# Altium schematic sheet Power_Measurement.SchDoc
size A4
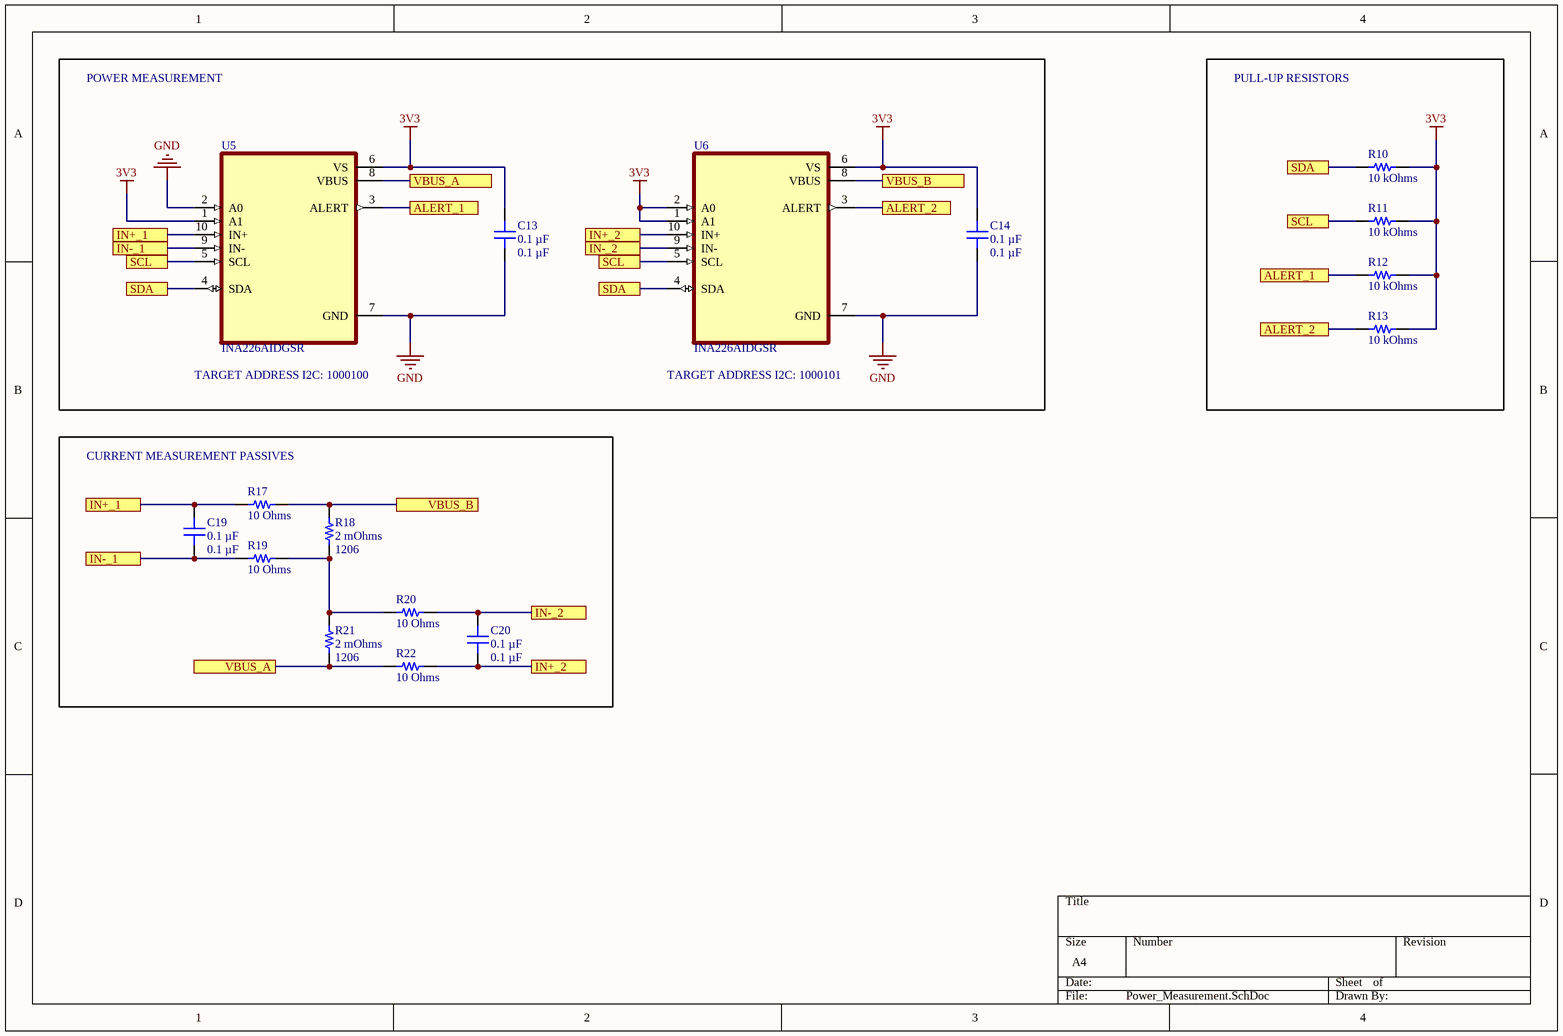
[diagram p0: Power_Measurement.SchDoc]

## Parts
C13  0.1 µF  [CAP 0603_1608]
C14  0.1 µF  [CAP 0603_1608]
C19  0.1 µF  [CAP 0603_1608]
C20  0.1 µF  [CAP 0603_1608]
R10  10 kOhms  [RES 0603_1608]
R11  10 kOhms  [RES 0603_1608]
R12  10 kOhms  [RES 0603_1608]
R13  10 kOhms  [RES 0603_1608]
R17  10 Ohms  [RES 0603_1608]
R18  2 mOhms  Package / Case: 1206  [STACKPOLE CSR1206]
R19  10 Ohms  [RES 0603_1608]
R20  10 Ohms  [RES 0603_1608]
R21  2 mOhms  Package / Case: 1206  [STACKPOLE CSR1206]
R22  10 Ohms  [RES 0603_1608]
U5  INA226AIDGSR  [SOP50P490X110-10N]
U6  INA226AIDGSR  [SOP50P490X110-10N]

## Blocks framed on the sheet
PULL-UP RESISTORS: R10-R13
CURRENT MEASUREMENT PASSIVES: C19 C20 R17-R22

## Ports
ALERT_1, ALERT_2, IN+_1, IN+_2, IN-_1, IN-_2, SCL, SDA, VBUS_A, VBUS_B

## Nets
3V3: C13.1 C14.2 R10.1 R11.1 R12.1 R13.1 U5.1(A1) U5.6(VS) U6.1(A1) U6.2(A0) U6.6(VS)
GND: C13.2 C14.1 U5.2(A0) U5.7(GND) U6.7(GND)
ALERT_1: R12.2 U5.3(ALERT) ; port ALERT_1
ALERT_2: R13.2 U6.3(ALERT) ; port ALERT_2
IN+_1: C19.2 R17.2 U5.10(IN+) ; port IN+_1
IN+_2: C20.2 R22.2 U6.10(IN+) ; port IN+_2
IN-_1: C19.1 R19.2 U5.9(IN-) ; port IN-_1
IN-_2: C20.1 R20.2 U6.9(IN-) ; port IN-_2
SCL: R11.2 U5.5(SCL) U6.5(SCL) ; port SCL
SDA: R10.2 U5.4(SDA) U6.4(SDA) ; port SDA
VBUS_A: R21.1 R22.1 U5.8(VBUS) ; port VBUS_A
VBUS_B: R17.1 R18.2 U6.8(VBUS) ; port VBUS_B
NetR18_1: R18.1 R19.1 R20.1 R21.2

## Notes on the sheet
- POWER MEASUREMENT
- TARGET ADDRESS I2C: 1000100
- TARGET ADDRESS I2C: 1000101

## Library data of the parts
C13 C14 C19 C20 = C0603C104K5RAC7411: CAP CER 0.1UF 50V X7R 0603; manufacturer: KEMET; Tolerance: ±10%; Part Number: C0603C104K5RAC7411; Value: 0.1 µF; Applications: Bypass, Decoupling; Capacitance: 0.1 µF; componentlink1description: Datasheet; componentlink1url: https://api.kemet.com/component-edge/download/datasheet/C0603C104K5RAC7411.pdf; componentlink2description: DigiKey Link; componentlink2url: https://www.digikey.com/en/products/detail/kemet/C0603C104K5RAC7411/3317013; Device Package: 0603 (1608 Metric); lastupdated: 21/08/2022 8:00:52 PM; Lifecycle Status: Active; Minimum Order: 15000; Mounting Type: Surface Mount, MLCC; Operating Temperature: -55°C ~ 125°C; Package / Case: 0603 (1608 Metric); packaging: TapeAndReel; partid: 2233; Part Status: Active; price: 0.01; series: SMD Comm X7R; Size / Dimension: 0.063" L x 0.031" W (1.60mm x 0.80mm); Supplier 1: DigiKey; Supplier Part Number 1: 399-7374-2-ND; Temperature Coefficient: X7R; Thickness (Max): 0.035" (0.90mm); Voltage - Rated: 50V
R10-R13 = RNCS0603BKE10K0: RES 10K OHM 0.1% 1/16W 0603; Manufacturer: Stackpole Electronics Inc; Power (Watts): 0.063W, 1/16W; Temperature Coefficient: ±25ppm/°C; Part Number: RNCS0603BKE10K0; Value: 10 kOhms; ComponentLink1Description: Datasheet; ComponentLink1URL: https://www.seielect.com/catalog/sei-rncs_rnch.pdf; ComponentLink2Description: DigiKey Link; ComponentLink2URL: https://www.digikey.com/en/products/detail/stackpole-electronics-inc/RNCS0603BKE10K0/1708836; Composition: Thin Film; Device Package: 0603 (1608 Metric); Features: Anti-Corrosive, Automotive AEC-Q200, Moisture Resistant; Height - Seated (Max): 0.022" (0.55mm); LastUpdated: 27/08/2022 7:54:13 AM; Lifecycle Status: Active; Minimum Order: 1; Number of Terminations: 2; Operating Temperature: -55°C ~ 155°C; Package / Case: 0603 (1608 Metric); Packaging: TapeAndReel; PartId: 4838; Part Status: Active; Price: 0.08; Ratings: AEC-Q200; Resistance: 10 kOhms; Series: RNCS; Size / Dimension: 0.061" L x 0.031" W (1.55mm x 0.80mm); Supplier 1: DigiKey; Supplier Part Number 1: RNCS0603BKE10K0CT-ND; Supplier Device Package: 0603; Tolerance: ±0.1%
R17 R19 R20 R22 = CRT0603-BY-10R0ELF: RES SMD 10 OHM 0.1% 1/10W 0603; Manufacturer: Bourns Inc.; Power (Watts): 0.1W, 1/10W; Temperature Coefficient: ±25ppm/°C; Part Number: CRT0603-BY-10R0ELF; Value: 10 Ohms; ComponentLink1Description: Datasheet; ComponentLink1URL: https://www.bourns.com/docs/Product-Datasheets/crt.pdf; ComponentLink2Description: DigiKey Link; ComponentLink2URL: https://www.digikey.com/en/products/detail/bourns-inc/CRT0603-BY-10R0ELF/1775018; Composition: Thin Film; Device Package: 0603 (1608 Metric); Features: Current Sense; Height - Seated (Max): 0.024" (0.60mm); LastUpdated: 19/09/2022 1:22:34 PM; Lifecycle Status: Active; Minimum Order: 1; Number of Terminations: 2; Operating Temperature: -55°C ~ 155°C; Package / Case: 0603 (1608 Metric); Packaging: TapeAndReel; PartId: 4866; Part Status: Active; Price: 0.04; Resistance: 10 Ohms; Series: CRT; Size / Dimension: 0.061" L x 0.031" W (1.55mm x 0.80mm); Supplier 1: DigiKey; Supplier Part Number 1: CRT0603-BY-10R0ELFCT-ND; Supplier Device Package: 0603; Tolerance: ±0.1%
R18 R21 = PCS1206FR0020ET: 1W 0.002 OHMS 1% 1206; Manufacturer: Ohmite; Temperature Coefficient: ±50ppm/°C; Part Number: PCS1206FR0020ET; ComponentLink2Description: DigiKey Link; ComponentLink2URL: https://www.digikey.com/en/products/detail/ohmite/PCS1206FR0020ET/10670849; Composition: Metal Film; Device Package: 1206 (3216 Metric); Features: Current Sense; Height - Seated (Max): 0.035" (0.88mm); LastUpdated: 19/09/2022 1:42:39 PM; Lifecycle Status: Active; Minimum Order: 1; Number of Terminations: 2; Operating Temperature: -55°C ~ 170°C; Packaging: TapeAndReel; PartId: 2876; Part Status: Active; Power (Watts): 1W; Price: 0.21; Ratings: AEC-Q200; Resistance: 2 mOhms; Series: PCS; Size / Dimension: 0.126" L x 0.065" W (3.20mm x 1.65mm); Supplier 1: DigiKey; Supplier Part Number 1: 273-PCS1206FR0020ETCT-ND; Supplier Device Package: 1206; Tolerance: ±1%; Value: 2 mOhms
U5 U6 = INA226AIDGSR: MF: {'manufacturer': u'Texas Instruments'}; Value: *; MP: INA226AIDGSR; Price: None; Availability: Unavailable; Package: None